# EAGLE board sunbeam2 (EAGLE 6.0), part 1 of 2
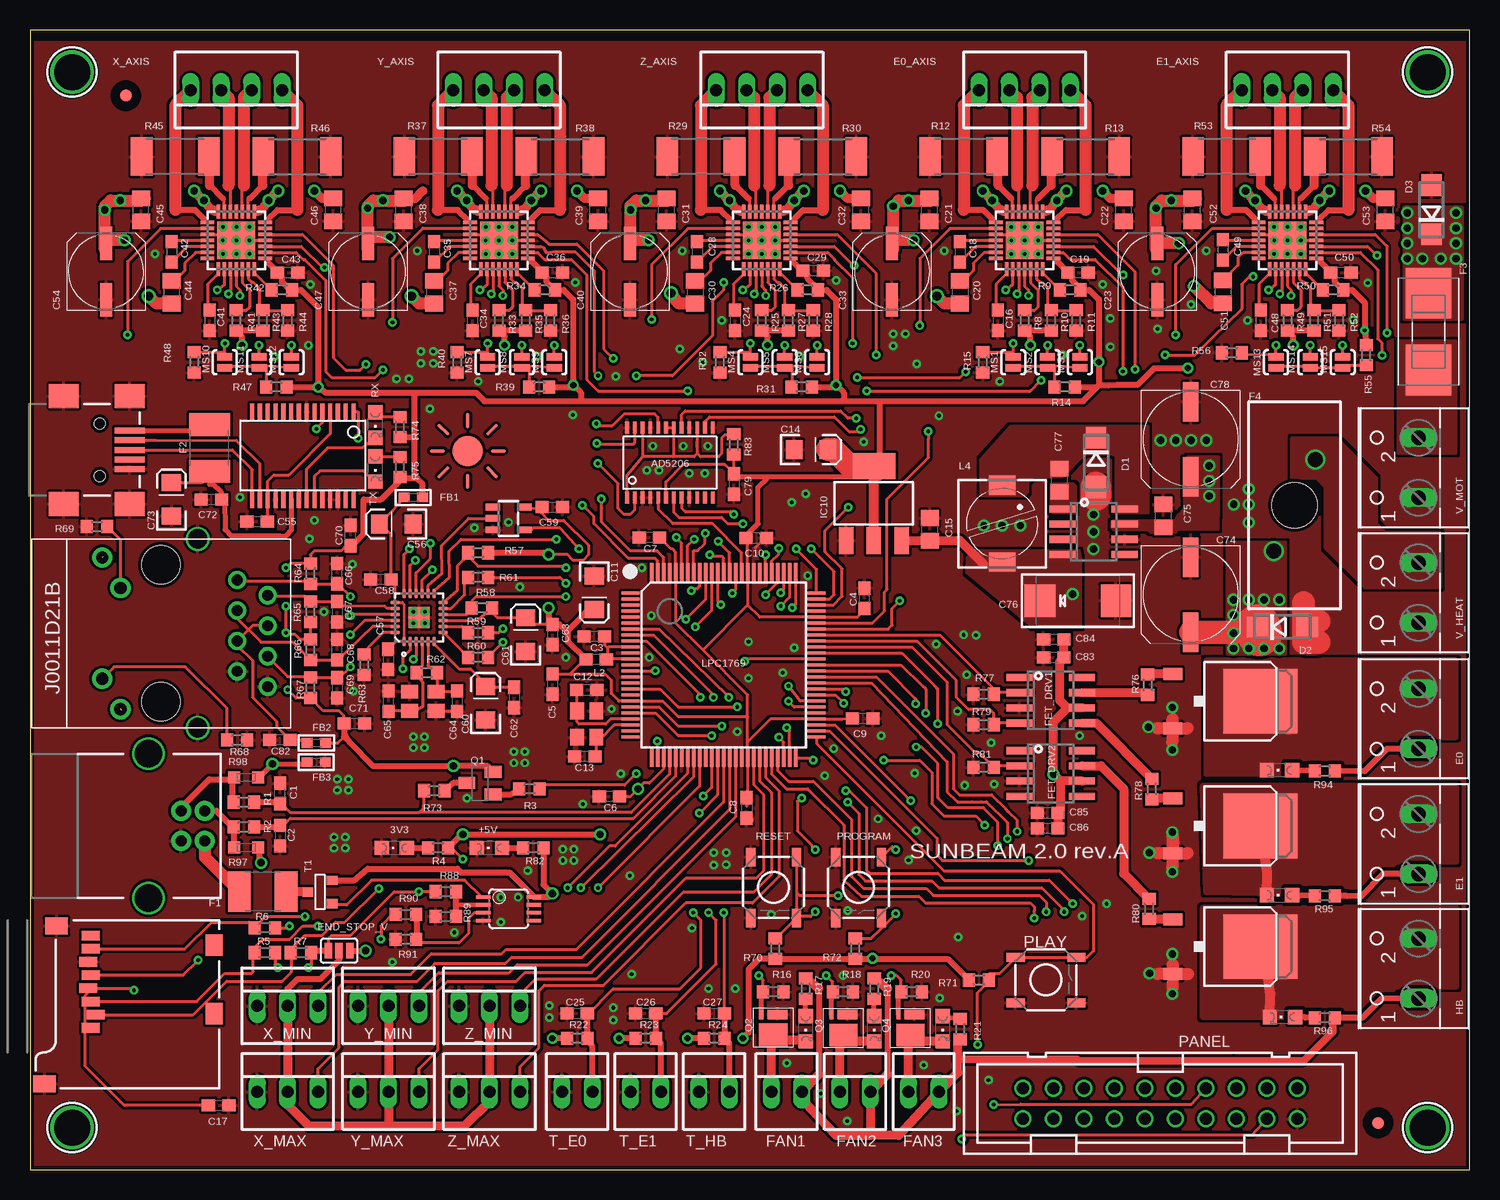
[diagram p2: board, top side]
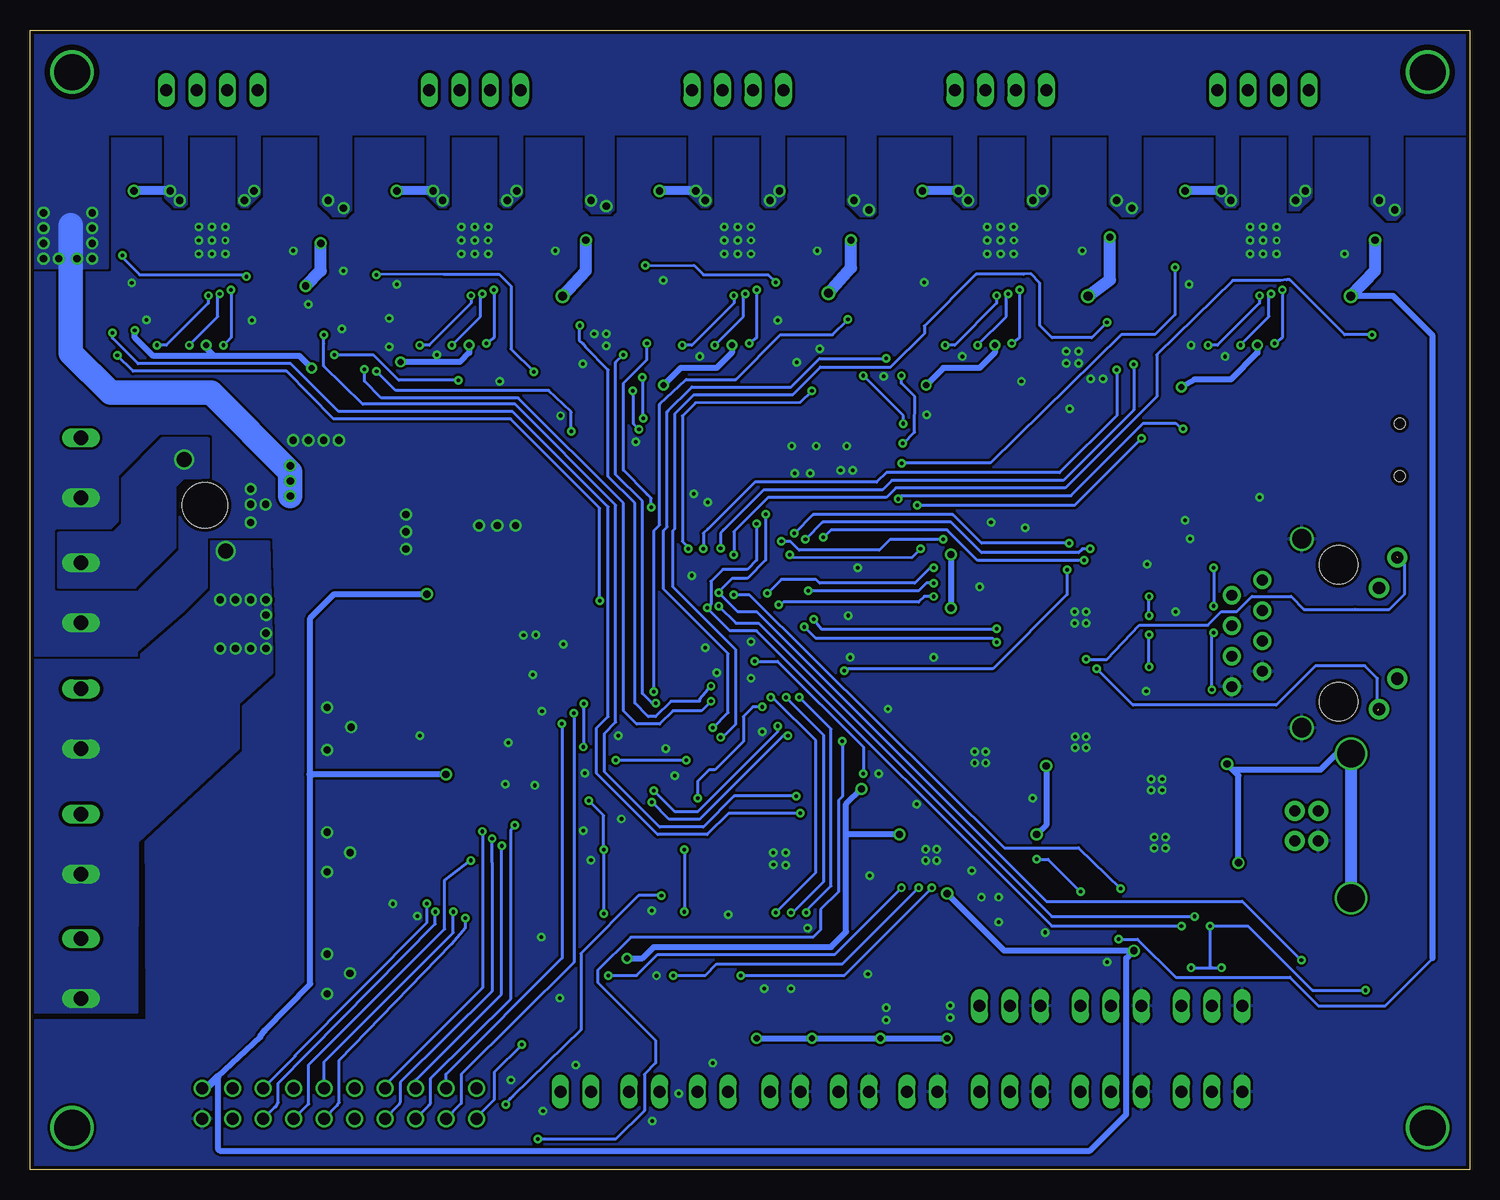
[diagram p3: board, bottom side, seen from below]

Size 120 x 95 mm. Coordinates in mm from the lower left corner, seen from the top.
Outline: 0,0 120,0 120,95 0,95 0,0
Copper layers (1*16): Top 0.07mm / dielectric 1.5mm / Bottom 0.07mm
Design rules: minimum track width 8mil, minimum drill 0.3mm, track to track 8mil, track to pad 8mil, pad to pad 8mil, via to via 8mil, smd to smd 0mil, copper to edge 12mil, drill to drill 10mil, minimum pad ring 8mil, minimum via ring 8mil, stop-mask expansion 0mil, vias tented up to drill 25mil, thermal gap 8mil

## Footprints (pad centres in the part's own frame; a part is rotated, then mirrored left to right if it is on the bottom)
CHIPLED_0805 = smd 1.2 x 1.2: A 0,-1.05; C 0,1.05
TSSOP24 = smd 0.305 x 0.991: 1 -3.575,-2.918; 2 -2.925,-2.918; 3 -2.275,-2.918; 4 -1.625,-2.918; 5 -0.975,-2.918; 6 -0.325,-2.918; 7 0.325,-2.918; 8 0.975,-2.918; 9 1.625,-2.918; 10 2.275,-2.918; 11 2.925,-2.918; 12 3.575,-2.918; 13 3.575,2.918; 14 2.925,2.918; 15 2.275,2.918; 16 1.625,2.918; 17 0.975,2.918; 18 0.325,2.918; 19 -0.325,2.918; 20 -0.975,2.918; 21 -1.625,2.918; 22 -2.275,2.918; 23 -2.925,2.918; 24 -3.575,2.918
C0603 = smd 1.1 x 1: 1 -0.85,0; 2 0.85,0
EIA3216 = smd 1.4 x 1.6: A 1.4,0; C -1.4,0
C0805 = smd 1.3 x 1.5: 1 -0.95,0; 2 0.95,0
UD-6,3X7,7_NICHICON = smd 2.8 x 1: + 2.35,0; - -2.35,0
UD-8X10_NICHICON = smd 3.3 x 1.3: + 3.125,0; - -3.125,0
EIA7343-31/D-R = smd 2.55 x 2.7: + 3.175,0; - -3.175,0
DO214AC = smd 1.8 x 1.7: A 2.05,0; C -2.05,0
W237-102 = drill 1.194 long: 1 -2.5,-1.27; 2 2.5,-1.27
22-23-2041 = drill 1 long: 1 -3.81,0; 2 -1.27,0; 3 1.27,0; 4 3.81,0
D-PAK_TO252AA = smd 1 x 1.6: 1 -2.28,-4.8; 3 2.28,-4.8 | smd 5.4 x 6.2: 4 0,2.5
SJ_3 = smd 0.635 x 1.27: 1 -0.889,0; 2 0,0; 3 0.889,0
L1812 = smd 1.9 x 3.4: 1 -1.95,0; 2 1.95,0
NANO2_SMF_FUSEBLOCK = smd 4.24 x 3.81: 1 -3.19,0; 2 3.19,0
01530008Z = drill 1.27: P$1 -1.73,-3.81; P$2 1.73,3.81 | hole 3.78: 0,0
22-23-2021 = drill 1 long: 1 -1.27,0; 2 1.27,0
_0603 = smd 0.9 x 0.8: 1 -0.762,0; 2 0.762,0
SOIC8 = smd 0.6 x 2.2: 1 -1.905,-2.6; 2 -0.635,-2.6; 3 0.635,-2.6; 4 1.905,-2.6; 5 1.905,2.6; 6 0.635,2.6; 7 -0.635,2.6; 8 -1.905,2.6
MOUNTINGHOLE_3.0_PLATEDTHIN = drill 3 pad 3.6: P$1 0,0
QFN28ET = smd 1.15 x 0.3: 1 -2.4,1.5; 2 -2.4,1; 3 -2.4,0.5; 4 -2.4,0; 5 -2.4,-0.5; 6 -2.4,-1; 7 -2.4,-1.5; 15 2.4,-1.5; 16 2.4,-1; 17 2.4,-0.5; 18 2.4,0; 19 2.4,0.5; 20 2.4,1; 21 2.4,1.5 | smd 0.3 x 1.15: 8 -1.5,-2.4; 9 -1,-2.4; 10 -0.5,-2.4; 11 0,-2.4; 12 0.5,-2.4; 13 1,-2.4; 14 1.5,-2.4; 22 1.5,2.4; 23 1,2.4; 24 0.5,2.4; 25 0,2.4; 26 -0.5,2.4; 27 -1,2.4; 28 -1.5,2.4 | smd 3.15 x 3.15: EXP 0,0
SSOP28DB = smd 0.348 x 1.397: 1 -4.225,-3.656; 2 -3.575,-3.656; 3 -2.925,-3.656; 4 -2.275,-3.656; 5 -1.625,-3.656; 6 -0.975,-3.656; 7 -0.325,-3.656; 8 0.325,-3.656; 9 0.975,-3.656; 10 1.625,-3.656; 11 2.275,-3.656; 12 2.925,-3.656; 13 3.575,-3.656; 14 4.225,-3.656; 15 4.225,3.656; 16 3.575,3.656; 17 2.925,3.656; 18 2.275,3.656; 19 1.625,3.656; 20 0.975,3.656; 21 0.325,3.656; 22 -0.325,3.656; 23 -0.975,3.656; 24 -1.625,3.656; 25 -2.275,3.656; 26 -2.925,3.656; 27 -3.575,3.656; 28 -4.225,3.656
SO08 = smd 0.6 x 2.2: 1 -1.905,-2.6; 2 -0.635,-2.6; 3 0.635,-2.6; 4 1.905,-2.6; 5 1.905,2.6; 6 0.635,2.6; 7 -0.635,2.6; 8 -1.905,2.6
MSOP08 = smd 0.3 x 1.2: 1 -0.976,-2.113; 2 -0.326,-2.113; 3 0.324,-2.113; 4 0.974,-2.113; 5 0.974,2.112; 6 0.324,2.112; 7 -0.326,2.112; 8 -0.976,2.112
SOT223 = smd 1.219 x 2.235: 1 -2.311,-3.099; 2 0,-3.099; 3 2.311,-3.099 | smd 3.6 x 2.2: TAB 0,3.099
0603 = smd 1.1 x 1: 1 -0.85,0; 2 0.85,0
PIS2816 = smd 2.2 x 1.6: 1 0,3.2; 2 0,-3.2
LQFP100 = smd 0.27 x 1.5: 1 -6,-7.75; 2 -5.5,-7.75; 3 -5,-7.75; 4 -4.5,-7.75; 5 -4,-7.75; 6 -3.5,-7.75; 7 -3,-7.75; 8 -2.5,-7.75; 9 -2,-7.75; 10 -1.5,-7.75; 11 -1,-7.75; 12 -0.5,-7.75; 13 0,-7.75; 14 0.5,-7.75; 15 1,-7.75; 16 1.5,-7.75; 17 2,-7.75; 18 2.5,-7.75; 19 3,-7.75; 20 3.5,-7.75; 21 4,-7.75; 22 4.5,-7.75; 23 5,-7.75; 24 5.5,-7.75; 25 6,-7.75; 51 6,7.75; 52 5.5,7.75; 53 5,7.75; 54 4.5,7.75; 55 4,7.75; 56 3.5,7.75; 57 3,7.75; 58 2.5,7.75; 59 2,7.75; 60 1.5,7.75; 61 1,7.75; 62 0.5,7.75; 63 0,7.75; 64 -0.5,7.75; 65 -1,7.75; 66 -1.5,7.75; 67 -2,7.75; 68 -2.5,7.75; 69 -3,7.75; 70 -3.5,7.75; 71 -4,7.75; 72 -4.5,7.75; 73 -5,7.75; 74 -5.5,7.75; 75 -6,7.75 | smd 1.5 x 0.27: 26 7.75,-6; 27 7.75,-5.5; 28 7.75,-5; 29 7.75,-4.5; 30 7.75,-4; 31 7.75,-3.5; 32 7.75,-3; 33 7.75,-2.5; 34 7.75,-2; 35 7.75,-1.5; 36 7.75,-1; 37 7.75,-0.5; 38 7.75,0; 39 7.75,0.5; 40 7.75,1; 41 7.75,1.5; 42 7.75,2; 43 7.75,2.5; 44 7.75,3; 45 7.75,3.5; 46 7.75,4; 47 7.75,4.5; 48 7.75,5; 49 7.75,5.5; 50 7.75,6; 76 -7.75,6; 77 -7.75,5.5; 78 -7.75,5; 79 -7.75,4.5; 80 -7.75,4; 81 -7.75,3.5; 82 -7.75,3; 83 -7.75,2.5; 84 -7.75,2; 85 -7.75,1.5; 86 -7.75,1; 87 -7.75,0.5; 88 -7.75,0; 89 -7.75,-0.5; 90 -7.75,-1; 91 -7.75,-1.5; 92 -7.75,-2; 93 -7.75,-2.5; 94 -7.75,-3; 95 -7.75,-3.5; 96 -7.75,-4; 97 -7.75,-4.5; 98 -7.75,-5; 99 -7.75,-5.5; 100 -7.75,-6
SJ_2S-NO = smd 0.635 x 1.27: 1 -0.45,0; 2 0.45,0
PAK100/2500-20 = drill 1 pad 1.422: 1 -11.43,-1.27; 2 -11.43,1.27; 3 -8.89,-1.27; 4 -8.89,1.27; 5 -6.35,-1.27; 6 -6.35,1.27; 7 -3.81,-1.27; 8 -3.81,1.27; 9 -1.27,-1.27; 10 -1.27,1.27; 11 1.27,-1.27; 12 1.27,1.27; 13 3.81,-1.27; 14 3.81,1.27; 15 6.35,-1.27; 16 6.35,1.27; 17 8.89,-1.27; 18 8.89,1.27; 19 11.43,-1.27; 20 11.43,1.27
TACTILE_SWITCH_SMD = smd 1.524 x 0.762: 1 -2.54,1.905; 2 2.54,1.905; 3 -2.54,-1.905; 4 2.54,-1.905
SOT23-BEC = smd 1 x 1.4: B -0.95,-1.1; C 0,1.1; E 0.95,-1.1
PQFN33 = smd 1.9 x 2.35: D 0,0 | smd 0.8 x 0.35: G -1.7,-1 | smd 0.8 x 1.68: S -1.7,0.35
R0603 = smd 1 x 1.1: 1 -0.85,0; 2 0.85,0
R2512 = smd 1.8 x 3.2: 1 -2.8,0; 2 2.8,0
CT/CN0603 = smd 1 x 1: 1 -1,0; 2 1,0
J0011D21B = drill 1.6: CHS1 7.874,-3.048; CHS2 -7.874,-3.048 | drill 0.889 pad 1.524: CT 0.635,-8.89; CT2 -0.635,-6.35; GND -4.445,-8.89; NC -3.175,-6.35; RD+ 1.905,-6.35; RD- -1.905,-8.89; TD+ 4.445,-6.35; TD- 3.175,-8.89 | drill 1.016 pad 1.676: G 6.325,4.902; G_GND 3.785,3.378; Y -6.325,3.378; Y_GND -3.785,4.902 | hole 3.2: -5.715,0; 5.715,0
SOT-23 = smd 0.787 x 0.889: 1 0.025,-1.016; 2 -0.94,1.016; 3 0.991,1.016
MICRO-SD-SOCKET-PP = smd 0.8 x 1.5: 1 -8.94,10.7; 2 -7.84,10.3; 3 -6.74,10.7; 4 -5.64,10.9; 5 -4.54,10.7; 6 -3.44,10.9; 7 -2.34,10.7; 8 -1.24,10.7 | smd 1.8 x 1.4: CD1 -2.05,0.4; CD2 -7.75,0.4 | smd 1.4 x 1.9: GND1 -13.6,14.55; GND3 -0.45,13.55
QFN24_4MM = smd 0.8 x 0.28: 1 -2,1.25; 2 -2,0.75; 3 -2,0.25; 4 -2,-0.25; 5 -2,-0.75; 6 -2,-1.25; 13 2,-1.25; 14 2,-0.75; 15 2,-0.25; 16 2,0.25; 17 2,0.75; 18 2,1.25 | smd 0.28 x 0.8: 7 -1.25,-2; 8 -0.75,-2; 9 -0.25,-2; 10 0.25,-2; 11 0.75,-2; 12 1.25,-2; 19 1.25,2; 20 0.75,2; 21 0.25,2; 22 -0.25,2; 23 -0.75,2; 24 -1.25,2 | smd 1.778 x 1.778: THERM 0,0
SOT23-5 = smd 0.55 x 1.2: 1 -0.95,-1.3; 2 0,-1.3; 3 0.95,-1.3; 4 0.95,1.3; 5 -0.95,1.3
USB-B-PTH = drill 0.914 pad 1.676: D+ 0,1.25; D- 1.981,1.25; GND 0,-1.25; VBUS 1.981,-1.25 | drill 2.286: S1 -2.718,-6.02; S2 -2.718,6.02
CRYSTAL2734 = smd 1.4 x 1.15: GND1 1.1,-0.8; GND2 -1.1,0.8; XTAL1 1.1,0.8; XTAL2 -1.1,-0.8
USB-MINIB = smd 2.5 x 0.5: D+ 2.5,0; D- 2.5,0.8; GND 2.5,-1.6; ID 2.5,-0.8; VBUS 2.5,1.6 | smd 2.5 x 2: MTN1 -3,4.5; MTN2 2.5,4.5; MTN3 -3,-4.5; MTN4 2.5,-4.5 | hole 0.9: 0,2.2; 0,-2.2
SUN = smd 2.54 x 2.54: P$1 0,0 | smd 0.305 x 1.27: P$2 0,2.54; P$3 0,-2.54 | smd 1.27 x 0.305: P$4 2.54,0; P$5 -2.54,0 | smd 1.27 x 0.305 rotated 45: P$6 2.032,1.778 | smd 1.27 x 0.305 rotated 135: P$7 2.032,-1.778 | smd 1.27 x 0.305 rotated 225: P$8 -2.032,-1.778 | smd 1.27 x 0.305 rotated 315: P$9 -2.032,1.778
FIDUCIAL_1MM = smd 1 x 1: 1 0,0
22-23-2031 = drill 1 long: 1 -2.54,0; 2 0,0; 3 2.54,0

## Placement (x,y rotation side)
3V3  [CHIPLED_0805]  30.37,26.82 90 top
+5V  [CHIPLED_0805]  38.31,26.82 90 top
AD5206  AD5206  [TSSOP24]  53.34,58.93 0 top
C1  18pF  [C0603]  20.84,31.36 90 top
C2  18pF  [C0603]  20.84,27.83 270 top
C3  0.1uF  [C0603]  47.04,44.44 180 top
C4  0.1uF  [C0603]  69.58,47.61 90 top
C5  0.1uF  [C0603]  43.54,40.47 270 top
C6  0.1uF  [C0603]  48.31,31.1 180 top
C7  0.1uF  [C0603]  51.64,52.69 180 top
C8  0.1uF  [C0603]  59.74,30.15 270 top
C9  0.1uF  [C0603]  69.42,37.61 0 top
C10  0.1uF  [C0603]  60.53,52.66 0 top
C11  10uF  [EIA3216]  47.04,48.09 270 top
C12  18pF  [C0603]  46.4,39.99 0 top
C13  18pF  [C0603]  46.24,34.44 180 top
C14  10uF  [EIA3216]  65.11,60.02 0 top
C15  0.1uF  [C0805]  75.01,53.36 90 top
C16  .22uF  [C0603]  80.69,70.79 270 top
C17  0.1uF  [C0603]  15.73,5.35 0 top
C18  1uF  [C0603]  77.52,76.5 270 top
C19  0.1uF  [C0603]  87.36,74.76 180 top
C20  0.1uF  [C0805]  77.52,73.14 270 top
C21  0.1uF  [C0805]  74.98,80 90 top
C22  0.1uF  [C0805]  91.17,80 90 top
C23  100uF  [UD-6,3X7,7_NICHICON]  93.96,74.85 90 top
C24  .22uF  [C0603]  58.78,70.79 270 top
C25  10uF  [C0603]  45.61,13 0 top
C26  10uF  [C0603]  51.32,13 0 top
C27  10uF  [C0603]  57.04,13 0 top
C28  1uF  [C0603]  55.61,76.5 270 top
C29  0.1uF  [C0603]  65.29,74.92 180 top
C30  0.1uF  [C0805]  55.45,73.14 270 top
C31  0.1uF  [C0805]  53.07,80 90 top
C32  0.1uF  [C0805]  69.26,80 90 top
C33  100uF  [UD-6,3X7,7_NICHICON]  71.87,74.85 90 top
C34  .22uF  [C0603]  36.88,70.79 270 top
C35  1uF  [C0603]  33.7,76.5 270 top
C36  0.1uF  [C0603]  43.54,74.76 180 top
C37  0.1uF  [C0805]  33.7,73.14 270 top
C38  0.1uF  [C0805]  31.16,80 90 top
C39  0.1uF  [C0805]  47.35,80 90 top
C40  100uF  [UD-6,3X7,7_NICHICON]  50.02,74.85 90 top
C41  .22uF  [C0603]  14.97,70.79 270 top
C42  1uF  [C0603]  11.79,76.5 270 top
C43  0.1uF  [C0603]  21.48,74.76 180 top
C44  0.1uF  [C0805]  11.79,73.14 270 top
C45  0.1uF  [C0805]  9.25,80 90 top
C46  0.1uF  [C0805]  25.29,80 90 top
C47  100uF  [UD-6,3X7,7_NICHICON]  28.18,74.85 90 top
C48  .22uF  [C0603]  102.6,70.79 270 top
C49  1uF  [C0603]  99.42,76.66 270 top
C50  0.1uF  [C0603]  109.27,74.76 180 top
C51  0.1uF  [C0805]  99.42,73.17 270 top
C52  0.1uF  [C0805]  96.88,80 90 top
C53  0.1uF  [C0805]  112.98,80 90 top
C54  100uF  [UD-6,3X7,7_NICHICON]  6.33,74.85 90 top
C55  0.1uF  [C0603]  18.94,54.03 0 top
C56  10uF  [EIA3216]  30.53,53.8 180 top
C57  0.1uF  [C0603]  29.86,42.53 270 top
C58  0.1uF  [C0603]  29.26,49.2 180 top
C59  0.1uF  [C0603]  43.54,55.23 0 top
C60  1uF  [EIA3216]  37.99,38.88 90 top
C61  10uF  [EIA3216]  41.32,44.6 90 top
C62  470pF  [C0603]  40.37,39.36 270 top
C63  0.1uF  [C0603]  43.54,44.6 270 top
C64  18pF  [C0603]  35.61,39.04 270 top
C65  18pF  [C0603]  29.89,39.04 90 top
C66  18pF  [C0603]  25.61,49.68 90 top
C67  18pF  [C0603]  25.61,46.5 270 top
C68  18pF  [C0603]  25.61,43.33 90 top
C69  18pF  [C0603]  25.61,40.15 270 top
C70  1uF  [C0603]  26.72,52.85 90 top
C71  1uF  [C0603]  27.03,37.2 0 top
C72  0.1uF  [C0603]  15.13,55.87 0 top
C73  10uF  [EIA3216]  11.79,55.87 90 top
C74  220uF  [UD-8X10_NICHICON]  96.76,47.93 270 top
C75  470nF  [C0805]  94.47,54.5 90 top
C76  47uF  [EIA7343-31/D-R]  87.36,47.42 180 top
C77  10nF  [C0805]  85.8,57.45 90 top
C78  100uF  [UD-8X10_NICHICON]  96.76,60.88 270 top
C79  0.1uF  [C0603]  58.67,57.15 270 top
C82  0.1uF  [C0603]  20.83,35.81 180 top
C83  0.1uF  [C0603]  85.34,42.67 180 top
C84  0.1uF  [C0603]  85.34,44.2 180 top
C85  4.7uF  [C0603]  84.84,29.72 180 top
C86  4.7uF  [C0603]  84.84,28.45 180 top
D1  SS14  [DO214AC]  88.85,58.95 270 top
D2  M4  [DO214AC]  104.39,45.21 0 top
D3  M4  [DO214AC]  116.84,80.01 90 top
E0  Extruder0  [W237-102]  114.47,37.58 90 top
E0_AXIS  22-23-2041  [22-23-2041]  82.91,90 180 top
E0_FET  IRLR8743  [D-PAK_TO252AA]  100.06,39.04 270 top
E1  Extruder1  [W237-102]  114.47,27.13 90 top
E1_AXIS  22-23-2041  [22-23-2041]  104.82,90 180 top
E1_FET  IRLR8743  [D-PAK_TO252AA]  100.06,28.64 270 top
END_STOP_V  [SJ_3]  25.76,18.24 180 top
F1  500mA  [L1812]  19.41,23.16 180 top
F2  500mA  [L1812]  14.97,60.15 90 top
F3  SMF_OMNIBLOK_154.062  [NANO2_SMF_FUSEBLOCK]  116.59,69.85 90 top
F4  01530008Z  [01530008Z]  105.41,55.37 180 top
FAN1  22-23-2021  [22-23-2021]  63.07,6.5 0 top
FAN2  22-23-2021  [22-23-2021]  68.79,6.5 0 top
FAN3  22-23-2021  [22-23-2021]  74.5,6.5 0 top
FB1  [_0603]  31.96,56.03 180 top
FB2  [_0603]  23.88,35.56 180 top
FB3  [_0603]  23.86,33.96 180 top
FET_DRV1  TC4427  [SOIC8]  85.09,39.12 270 top
FET_DRV2  TC4427  [SOIC8]  85.09,33.02 270 top
GND  MOUNTINGHOLE3.0THIN  [MOUNTINGHOLE_3.0_PLATEDTHIN]  3.5,91.5 0 top
HB  HotBed  [W237-102]  114.47,16.75 90 top
HOTBET_FET  IRLR8743  [D-PAK_TO252AA]  100.06,18.58 270 top
IC2  A4983  [QFN28ET]  82.91,77.46 0 top
IC3  A4983  [QFN28ET]  61.01,77.46 0 top
IC4  A4983  [QFN28ET]  39.1,77.46 0 top
IC5  A4983  [QFN28ET]  17.19,77.46 0 top
IC6  A4983  [QFN28ET]  104.82,77.46 0 top
IC7  FT232RLSSOP  [SSOP28DB]  22.75,59.52 180 top
IC8  LM2675  [SO08]  88.66,53.17 270 top
IC9  LMV358MMX  [MSOP08]  39.89,21.74 270 top
IC10  LM1117IMPX-3.3  [SOT223]  70.34,55.55 0 top
L2  [0603]  47.2,42.53 180 top
L4  33uH  [PIS2816]  81.03,53.85 0 top
LED2  [CHIPLED_0805]  64.66,11.73 180 top
LED3  [CHIPLED_0805]  70.37,11.73 180 top
LED4  [CHIPLED_0805]  76.09,11.73 180 top
LED6  [CHIPLED_0805]  104.16,33.29 90 top
LED7  [CHIPLED_0805]  104.16,22.87 90 top
LED8  [CHIPLED_0805]  104.4,12.71 90 top
LPC1769  [LQFP100]  57.83,42.06 270 top
MS1  SOLDERJUMPERNO  [SJ_2S-NO]  81.96,67.3 90 top
MS2  SOLDERJUMPERNO  [SJ_2S-NO]  84.82,67.3 90 top
MS3  SOLDERJUMPERNO  [SJ_2S-NO]  87.52,67.3 90 top
MS4  SOLDERJUMPERNO  [SJ_2S-NO]  60.05,67.3 90 top
MS5  SOLDERJUMPERNO  [SJ_2S-NO]  62.91,67.3 90 top
MS6  SOLDERJUMPERNO  [SJ_2S-NO]  65.61,67.3 90 top
MS7  SOLDERJUMPERNO  [SJ_2S-NO]  38.15,67.3 90 top
MS8  SOLDERJUMPERNO  [SJ_2S-NO]  41,67.3 90 top
MS9  SOLDERJUMPERNO  [SJ_2S-NO]  43.7,67.3 90 top
MS10  SOLDERJUMPERNO  [SJ_2S-NO]  16.24,67.3 90 top
MS11  SOLDERJUMPERNO  [SJ_2S-NO]  19.1,67.3 90 top
MS12  SOLDERJUMPERNO  [SJ_2S-NO]  21.8,67.3 90 top
MS13  SOLDERJUMPERNO  [SJ_2S-NO]  103.87,67.3 90 top
MS14  SOLDERJUMPERNO  [SJ_2S-NO]  106.73,67.3 90 top
MS15  SOLDERJUMPERNO  [SJ_2S-NO]  109.43,67.3 90 top
PANEL  2520-  [PAK100/2500-20]  94.22,5.51 180 top
PLAY  [TACTILE_SWITCH_SMD]  84.7,15.8 0 top
PROGRAM  [TACTILE_SWITCH_SMD]  69.07,23.51 270 top
Q1  BC857ALT1SMD  [SOT23-BEC]  37.51,32.21 90 top
Q2  IRLHM630TR2PBF  [PQFN33]  61.96,11.23 270 top
Q3  IRLHM630TR2PBF  [PQFN33]  67.8,11.21 270 top
Q4  IRLHM630TR2PBF  [PQFN33]  73.39,11.21 270 top
R1  33R  [R0603]  17.83,30.63 0 top
R2  33R  [R0603]  17.83,28.56 0 top
R3  470R  [R0603]  41.64,31.74 180 top
R4  1K  [R0603]  34.02,26.82 180 top
R5  10K  [R0603]  19.57,18.08 0 top
R6  10K  [R0603]  19.57,20.15 0 top
R7  10K  [R0603]  22.59,18.08 0 top
R8  10K  [R0603]  82.91,70.79 90 top
R9  10K  [R0603]  86.72,73.33 180 top
R10  10K  [R0603]  85.14,70.79 90 top
R11  10K  [R0603]  87.2,70.79 90 top
R12  0.5R  [R2512]  77.83,84.44 180 top
R13  0.5R  [R2512]  87.99,84.44 0 top
R14  10K  [R0603]  86.25,65.23 0 top
R15  10K  [R0603]  79.42,67.3 270 top
R16  10K  [R0603]  61.96,14.81 180 top
R17  1K5  [R0603]  64.66,15.07 270 top
R18  10K  [R0603]  67.77,14.81 180 top
R19  1K5  [R0603]  70.37,15.07 270 top
R20  10K  [R0603]  73.49,14.81 180 top
R21  1K5  [R0603]  77.55,11.7 90 top
R22  4K7  [R0603]  45.61,10.94 180 top
R23  4K7  [R0603]  51.32,10.94 180 top
R24  4K7  [R0603]  57.04,10.94 180 top
R25  10K  [R0603]  61.01,70.79 90 top
R26  10K  [R0603]  64.82,73.33 180 top
R27  10K  [R0603]  63.23,70.79 90 top
R28  10K  [R0603]  65.29,70.79 90 top
R29  0.5R  [R2512]  55.93,84.44 180 top
R30  0.5R  [R2512]  66.09,84.44 0 top
R31  10K  [R0603]  64.34,65.23 0 top
R32  10K  [R0603]  57.51,67.3 270 top
R33  10K  [R0603]  39.1,70.79 90 top
R34  10K  [R0603]  42.91,73.33 180 top
R35  10K  [R0603]  41.32,70.79 90 top
R36  10K  [R0603]  43.39,70.79 90 top
R37  0.5R  [R2512]  34.02,84.44 180 top
R38  0.5R  [R2512]  44.18,84.44 0 top
R39  10K  [R0603]  42.43,65.23 0 top
R40  10K  [R0603]  35.61,67.3 270 top
R41  10K  [R0603]  17.19,70.79 90 top
R42  10K  [R0603]  21,73.33 180 top
R43  10K  [R0603]  19.41,70.79 90 top
R44  10K  [R0603]  21.48,70.79 90 top
R45  0.5R  [R2512]  12.11,84.44 180 top
R46  0.5R  [R2512]  22.27,84.44 0 top
R47  10K  [R0603]  20.53,65.23 0 top
R48  10K  [R0603]  13.7,67.3 270 top
R49  10K  [R0603]  104.82,70.79 90 top
R50  10K  [R0603]  108.63,73.33 180 top
R51  10K  [R0603]  107.04,70.79 90 top
R52  10K  [R0603]  109.11,70.79 90 top
R53  0.5R  [R2512]  99.74,84.44 180 top
R54  0.5R  [R2512]  109.9,84.44 0 top
R55  10K  [R0603]  111.39,67.9 90 top
R56  10K  [R0603]  100.19,68.09 180 top
R57  1K5  [R0603]  37.35,51.42 180 top
R58  10K  [R0603]  37.67,46.82 180 top
R59  22R  [R0603]  37.35,44.75 0 top
R60  22R  [R0603]  37.35,42.69 0 top
R61  22R  [R0603]  37.35,49.36 0 top
R62  1M  [R0603]  33.07,41.42 180 top
R63  1K5  [R0603]  27.86,42.09 270 top
R64  49.9R  [R0603]  23.38,49.68 270 top
R65  49.9R  [R0603]  23.38,46.5 90 top
R66  49.9R  [R0603]  23.38,43.33 270 top
R67  49.9R  [R0603]  23.38,40.15 90 top
R68  330R  [R0603]  17.27,35.81 0 top
R69  330R  [R0603]  5.59,53.59 180 top
R70  10K  [R0603]  62.12,18.4 270 top
R71  10K  [R0603]  79.11,15.8 180 top
R72  10K  [R0603]  68.79,18.4 270 top
R73  1K5  [R0603]  33.7,31.58 0 top
R74  1K  [R0603]  30.84,61.9 90 top
R75  1K  [R0603]  30.84,58.57 90 top
R76  22R  [R0603]  93.17,40.41 270 top
R77  10K  [R0603]  79.5,39.62 180 top
R78  22R  [R0603]  93.51,31.72 90 top
R79  10K  [R0603]  79.5,37.08 180 top
R80  22R  [R0603]  93.28,21.73 90 top
R81  10K  [R0603]  79.5,33.53 180 top
R82  1K  [R0603]  41.96,26.82 180 top
R83  10K  [R0603]  58.67,60.45 270 top
R88  10K  [R0603]  34.65,23.16 180 top
R89  10K  [R0603]  34.65,21.1 180 top
R90  4K7  [R0603]  31.32,21.26 180 top
R91  1K  [R0603]  31.32,19.2 180 top
R94  1K5  [R0603]  107.93,33.23 180 top
R95  1K5  [R0603]  107.93,22.82 180 top
R96  1K5  [R0603]  107.94,12.66 180 top
R97  VARISTORCN0603  [CT/CN0603]  18.02,26.85 0 top
R98  VARISTORCN0603  [CT/CN0603]  18.02,32.69 0 top
RESET  [TACTILE_SWITCH_SMD]  61.99,23.51 270 top
RJ1  ETHERNET  [J0011D21B]  10.92,44.7 90 top
RX  [CHIPLED_0805]  28.78,62.06 180 top
T1  IRLML2246TRPBF  [SOT-23]  24.18,23.16 270 top
T_E0  22-23-2021  [22-23-2021]  45.61,6.5 0 top
T_E1  22-23-2021  [22-23-2021]  51.32,6.5 0 top
T_HB  22-23-2021  [22-23-2021]  57.04,6.5 0 top
TX  [CHIPLED_0805]  28.78,58.41 180 top
U2  USD-SOCKETNEW  [MICRO-SD-SOCKET-PP]  15.76,20.75 90 top
U3  [QFN24_4MM]  32.43,46.02 90 top
U4  [SOT23-5]  39.89,54.28 270 top
U$1  USB+SHIELD  [USB-B-PTH]  12.59,28.66 0 top
U$3  12Mhz  [CRYSTAL2734]  46.4,37.13 270 top
U$7  USB-MINIB-5PIN  [USB-MINIB]  5.83,59.99 0 top
U$8  25Mhz  [CRYSTAL2734]  32.75,39.04 180 top
U$17  MOUNTINGHOLE3.0THIN  [MOUNTINGHOLE_3.0_PLATEDTHIN]  3.5,3.5 0 top
U$18  MOUNTINGHOLE3.0THIN  [MOUNTINGHOLE_3.0_PLATEDTHIN]  116.5,3.5 0 top
U$20  MOUNTINGHOLE3.0THIN  [MOUNTINGHOLE_3.0_PLATEDTHIN]  116.5,91.5 0 top
U$21  SUNLOGO  [SUN]  36.5,59.9 0 top
U$22  FIDUCIAL  [FIDUCIAL_1MM]  112.38,3.89 0 top
U$23  FIDUCIAL  [FIDUCIAL_1MM]  7.98,89.52 0 top
V_HEAT  HEATERS  [W237-102]  114.47,48.09 90 top
V_MOT  MOTORS  [W237-102]  114.47,58.5 90 top
X_AXIS  22-23-2041  [22-23-2041]  17.19,90 180 top
X_MAX  22-23-2031  [22-23-2031]  21.48,6.5 0 top
X_MIN  22-23-2031  [22-23-2031]  21.48,13.64 0 top
Y_AXIS  22-23-2041  [22-23-2041]  39.1,90 180 top
Y_MAX  22-23-2031  [22-23-2031]  29.89,6.5 0 top
Y_MIN  22-23-2031  [22-23-2031]  29.89,13.64 0 top
Z_AXIS  22-23-2041  [22-23-2041]  61.01,90 180 top
Z_MAX  22-23-2031  [22-23-2031]  38.31,6.5 0 top
Z_MIN  22-23-2031  [22-23-2031]  38.31,13.64 0 top

## Tracks (layer width: path | path; a pad name or v marks a point on that pad's centre or on a via)
1,65V
  Top 0.381: IC9.2 35.51,22.06
  Top 0.508: R89.1 35.51,22.06 R88.1
5V  (via drill 0.6)
  Top 0.305: C15.1 74.72,52.41 74.68,52.45
  Top 0.508: T1.2 27.02,24.11 28.15,25.07 35.61,25.07 35.92,24.75 39.97,24.75 IC9.8 43.25,22.71 v43.55,23.01 42.81,23.74 R82.1 | END_STOP_V.1 v27.99,18.24
  Top 0.762: 79.5,50.46 77.5,52.45 74.68,52.45 IC10.3 72.91,51.97 | FET_DRV2.6 85.89,32.38 | 85.89,32.38 v85.33,32.94 85.33,37.32 86.49,38.48 | FET_DRV1.6 86.49,38.48 | 85.89,32.38 85.89,29.92 C85.1 C86.1 | 86.49,38.48 85.85,39.12 85.85,42.33 C83.1 C84.1
  Bottom 0.508: v43.55,23.01 38.78,18.24 v27.99,18.24 28.62,17.61 28.62,4.59 31.64,1.57 104.19,1.57 104.35,1.73 104.35,7.73 100.79,11.06 100.77,11.16 100.42,11.6 | 100.42,11.6 96.63,15.48 96.63,32.94 96.63,45.96 94.63,47.96 v86.92,47.96 | v85.33,32.94 96.5,32.94 | 100.42,11.61 100.42,11.6
  Bottom 0.61: PANEL.1 105.3,6.78 104.35,7.73
  Bottom 0.635: 96.5,32.94 96.63,32.94
  pour Top (no thermals): 87.49,51.58 78.6,51.58 78.09,51 78.07,49.79 83.58,45.23 87.61,45.23 87.61,50.95
+3V3  (via drill 0.3, 0.5, 0.51, 0.6)
  Top 0.254: U3.9 37.32,45.77 R58.1 38.31,46.66 38.97,46 C61.A 41.71,45.45 C63.1 43.44,45.45 43.39,45.39 | R65.1 R66.1 22.53,44.18 22.11,44.6 21.48,44.6 v21.32,44.76 v21.32,46.98 | C71.1 26.18,37.83 25.77,38.25 24.44,38.25 R67.1 22.17,39.3 v21.48,39.99 | LPC1769.28 52.83,33.41 51.64,32.21 51.16,32.21 v50.69,31.74 50.05,31.1 C6.1 49.1,31.1 | C5.1 45.03,41.32 | 45.03,41.32 46.24,42.53 L2.2 | 45.03,41.32 45.09,41.26 47.99,41.26 48.47,40.79 48.47,39.67 49.09,39.06 LPC1769.19 52.74,39.06 54.02,37.77 59.83,37.77 | R64.1 21.69,50.53 v21.32,50.15 | C9.1 67.72,37.56 LPC1769.54 61.75,37.56 59.83,35.64 LPC1769.42 | LPC1769.42 59.83,30.4 59.74,30.31 C8.1 | 59.83,52.72 LPC1769.84 59.83,47.07 | C70.1 26.34,52 25.92,51.58 23.7,51.58 23.38,51.26 R64.1 | R64.1 23.38,50.47 | LPC1769.42 59.83,37.77 | 59.83,37.77 59.83,39.58 56.09,43.33 | 56.09,43.33 53.83,45.58 LPC1769.96 53.83,51.45 53.55,51.74 53.44,51.74 C7.1 | 59.83,47.07 56.09,43.33 | 59.83,47.07 60.85,46.06 LPC1769.71 68.98,46.06 69.58,46.66 C4.1 | U4.5 42.59,55.07 | 42.59,55.07 42.59,54.76 43.23,54.12 44.5,54.12 46.56,52.06 46.56,51.26 46.09,50.79 45.29,50.79 44.81,51.26 v43.23,51.26 | R7.2 23.44,17.03 v23.23,16.82 | R5.2 20.42,17.08 v20.68,16.82 | R6.2 21.48,20.15 v21.64,20.31 | R4.1 35.13,26.82 v36.08,25.86 | R88.2 v32.43,23.16 30.37,23.16 26.72,19.51 25.13,19.51 24.88,19.26 END_STOP_V.3 | IC3.15 63.41,75.85 63.55,75.71 | IC5.15 19.59,75.85 19.73,75.71 | IC4.15 41.5,75.85 41.64,75.71 | IC2.15 85.31,75.85 85.45,75.71 | IC6.15 107.22,75.85 107.36,75.71 | 25.92,37.2 26.64,35.63 | v8.65,14.94 8.57,15.11 U2.4 5.21,15.11 4.57,14.48 4.57,8.64 7.86,5.35
  Top 0.254: 42.59,55.07 42.59,55.13 C59.1 | 7.86,5.35 7.87,5.33 | C17.1 7.86,5.35 | R83.2 C79.1 58.67,58.01 57.94,58.75 54.44,58.76 53.02,57.33 AD5206.6 | FB2.1 25.66,35.56 26.18,36.08
  Top 0.406: 70.34,57.71 61.47,57.71 | 61.47,57.71 58.87,57.71 58.67,57.91 C79.1 | 61.47,57.71 61.47,57.66 60.71,56.9 60.71,53.85 59.83,52.97 59.83,52.72 59.75,52.72 C10.1
  Top 0.508: v105.3,68.73 105.3,69.46 R49.1 R51.1 | 89.11,65.39 v89.11,67.33 89.11,72.54 88.31,73.33 R9.1 87.58,73.43 86.88,74.12 86.88,74.39 C19.2 86.57,74.76 85.61,75.71 85.45,75.71 | R14.2 88.95,65.23 | 88.95,65.23 89.11,65.39 | v83.39,68.73 83.39,69.46 R8.1 R10.1 | v67.2,65.39 67.2,72.54 66.41,73.33 R26.1 65.67,73.43 64.82,74.28 64.82,74.54 C29.2 64.5,74.86 64.5,74.76 63.55,75.71 | v67.2,65.39 67.83,64.76 67.83,64.12 67.64,64.06 | R31.2 67.04,65.23 v67.2,65.39 | v61.48,68.73 61.48,69.46 R25.1 R27.1 | v45.29,65.39 45.29,72.54 44.5,73.33 R34.1 43.7,73.33 43.07,73.97 43.07,74.39 C36.2 42.75,74.76 41.8,75.71 41.64,75.71 | v45.29,65.39 45.93,64.76 45.93,64.22 46.09,64.06 | R39.2 45.13,65.23 v45.29,65.39 | v39.58,68.73 39.58,69.46 R33.1 R35.1 | v24.02,65.23 24.02,71.9 22.59,73.33 R42.1 21.64,73.33 21,73.97 21,74.39 C43.2 20.68,74.76 19.73,75.71 | v24.02,65.23 24.65,64.76 32.27,64.76 | R47.2 v24.02,65.23 | v17.67,68.73 17.67,69.46 R41.1 R43.1 | 32.27,64.76 37.2,64.76 37.89,64.06 46.09,64.06 | 46.09,64.06 67.64,64.06 | 67.64,64.06 70.85,64.06 | 70.85,64.06 87.77,64.06 88.95,65.23 | C63.1 44.12,45.45 44.81,44.76 | 44.81,44.76 44.81,44.01 L2.2 | C70.1 26.98,52.16 27.83,53.01 27.83,55.87 29.26,55.87 31,57.61 | R72.2 70.22,17.55 | R22.2 v43.55,10.94 | R23.2 v49.1,10.94 | R24.2 v54.82,10.94 | v59.42,10.94 59.9,11.42 59.9,16.69 60.76,17.55 R70.2 R72.2 | 89.11,65.39 89.9,65.39 90.63,65.42 92.35,65.42 93.73,66.8 v96.52,66.8 | R55.2 v111.27,69.96 111.27,72.28 110.22,73.33 R50.1 109.43,73.33 108.79,73.97 108.79,74.39 C50.2 108.47,74.76 107.52,75.71 107.36,75.71 | v70.22,17.61 70.22,17.55 | C7.1 52.49,52.91
  Top 0.508: END_STOP_V.3 23.6,18.24 R7.2 | v47.51,27.93 v36.08,27.93 35.98,27.93 R4.1 | 44.81,44.76 44.81,44.91 47.04,47.14 C11.A | R57.1 43.07,51.42 v43.23,51.26 | v43.23,46.82 43.23,45.55 43.39,45.39 | Q1.E 38.15,33.64 v35.29,33.64 | v35.29,33.64 35.45,33.64 | 32.08,57.61 32.08,60.95 | 32.08,60.95 32.08,64.57 32.27,64.76 | 32.08,57.61 32.27,57.61 32.72,57.17 FB1.1 | 32.08,57.61 31,57.61 | 31,57.61 30.95,57.61 R75.1 | R74.1 32.01,61.05 32.12,60.95 32.08,60.95 | C71.1 26.18,36.08 26.64,35.63 28.62,33.64 v35.29,33.64 | 70.6,57.84 70.85,58.09 | 70.85,58.09 IC10.TAB 70.85,57.84 | 70.85,58.09 70.85,64.06 | 71.45,58.51 71.36,58.09 70.85,58.09 | R72.2 68.81,17.55 68.83,17.53 | 70.22,17.55 76.5,17.55 R71.2
  Top 0.813: IC10.2 70.34,57.71 IC10.TAB | IC10.TAB 70.85,57.9 70.87,57.91 70.87,57.9 IC10.TAB
  Top 1.93: C14.A 66.98,60.02 68.33,58.67 70.36,58.67 70.36,58.66 IC10.TAB
  Bottom 0.254: v21.48,39.99 21.48,44.44 v21.32,44.76 | v21.32,50.15 v21.32,46.98 | v23.23,16.82 21.48,16.82 | 21.48,16.82 v20.68,16.82 | 21.48,16.82 21.64,16.97 v21.64,20.31 18.46,20.31 13.1,14.94 v8.65,14.94 | v36.08,25.86 35.13,25.86 v32.43,23.16
  Bottom 0.508: v83.39,68.73 83.39,68.09 84.15,67.33 v89.11,67.33 | v61.48,68.73 61.48,68.09 62.75,66.82 65.77,66.82 v67.2,65.39 | v39.58,68.73 39.58,68.09 40.85,66.82 43.86,66.82 v45.29,65.39 | v17.67,68.73 17.67,68.09 19.89,65.87 22.91,65.87 v24.02,65.23 | v59.42,10.94 v54.82,10.94 v49.1,10.94 v43.55,10.94 | v50.69,31.74 51.96,30.47 51.96,27.93 | 51.96,27.93 51.96,19.83 53.23,18.56 67.99,18.56 68.94,17.61 v70.22,17.61 | v35.29,33.64 35.29,28.72 v36.08,27.93 | v47.51,27.93 51.96,27.93 | v43.23,51.26 v43.23,46.82 | v96.52,66.8 97.54,67.82 104.65,67.82 | v105.3,68.73 105.3,68.47 104.65,67.82 | 104.65,67.82 109.73,67.82 111.25,69.34 111.25,69.95 v111.27,69.96
+12V  (via drill 0.3, 0.6, 0.76)
  Top 0.254: IC6.28 103.06,79.86 | IC6.22 106.59,79.86 | IC5.28 15.43,79.86 | IC5.22 18.96,79.86 | IC4.28 37.34,79.86 | IC4.22 40.87,79.86 | IC3.28 59.24,79.86 | IC3.22 62.77,79.86 | IC2.28 81.15,79.86 | IC2.22 84.68,79.86 | v29.26,19.2 29.26,20.31 30.37,21.42 30.53,21.42 30.53,21.26 R90.2 | C40.+ 50.04,77.22 50.04,77.47 | 71.88,77.47 71.88,77.22 C33.+ | C47.+ 28.18,77.71 28.19,77.72 | 6.35,77.47 6.35,77.22 C54.+ | C31.2 53.07,80.81 53.09,80.79
  Top 0.406: C47.+ 28.18,76.7 | 28.15,76.7 28.18,76.7 | 28.18,76.7 28.18,76.63 | 50.05,76.7 50.02,76.7 C40.+ | C33.+ 71.96,77.2 71.96,77.14 | 93.87,76.7 93.96,76.7 C23.+ | C54.+ 6.24,77.2 6.24,76.89
  Top 0.762: 103.06,79.86 102.92,80 102.76,80 v102.12,80.79 v101.33,81.58 | 106.59,79.86 106.73,80 106.89,80 v107.52,80.79 v108.31,81.58 | C53.2 111.97,80.95 v111.33,81.58 | 15.43,79.86 15.29,80 15.13,80 v14.49,80.79 v13.7,81.58 | 18.96,79.86 19.1,80 19.26,80 v19.89,80.79 v20.68,81.58 | C46.2 24.34,80.95 v23.7,81.58 | 37.34,79.86 37.2,80 37.04,80 v36.4,80.79 v35.61,81.58 | 40.87,79.86 41.01,80 41.16,80 v41.8,80.79 v42.59,81.58 | C38.2 32.11,80.95 32.75,81.58 | C39.2 46.25,80.95 v45.61,81.58 | 59.24,79.86 59.1,80 58.94,80 v58.31,80.79 v57.52,81.58 | 62.77,79.86 62.91,80 63.07,80 v63.71,80.79 v64.5,81.58 | C32.2 68.15,80.95 v67.52,81.58 | 81.15,79.86 81.01,80 80.85,80 v80.22,80.79 v79.42,81.58 | 84.68,79.86 84.82,80 84.98,80 v85.61,80.79 v86.41,81.58 | C22.2 90.06,80.95 v89.42,81.58
  Top 1.016: 93.87,76.7 v93.87,80.16 93.87,80.31 94.34,80.79 v95.14,80.79 97.04,80.79 97.2,80.95 C52.2 | 6.24,76.7 6.24,76.89 v6.24,80 6.24,80.31 6.71,80.79 v7.51,80.79 9.41,80.79 9.57,80.95 C45.2 | C44.2 10.52,72.19 v9.89,72.82 | 28.15,76.7 v28.15,80.16 28.15,80.31 28.62,80.79 v29.42,80.79 31.32,80.79 31.48,80.95 C38.2 | C37.2 32.43,72.19 v31.8,72.82 | 50.05,76.7 v50.05,80 50.05,80.31 50.53,80.79 v51.32,80.79 53.09,80.79 53.23,80.79 | C31.2 | C30.2 54.08,72.19 v53.45,73.08 | 71.96,76.7 71.96,77.14 v71.96,80.31 72.44,80.79 v73.23,80.79 75.14,80.79 75.3,80.95 C21.2 | C20.2 76.25,72.19 v75.61,72.82 | v29.97,77.72 28.19,77.72 | v73.66,77.47 71.88,77.47 | v51.56,77.47 50.04,77.47 | v7.87,77.47 6.35,77.47 | C51.2 98.47,72.22 v97.03,73.66 | v95.76,77.22 93.98,77.22 C23.+
  Bottom 0.254: 3.06,17.61 7.03,13.64 12.59,13.64 14.97,16.02 24.5,16.02 27.67,19.2 v29.26,19.2
  Bottom 0.508: 3.06,17.61 3.06,69.52 6.37,72.82 v9.89,72.82
  Bottom 0.762: v108.31,81.58 v111.33,81.58 | v20.68,81.58 v23.7,81.58 | v42.59,81.58 v45.61,81.58 | v64.5,81.58 v67.52,81.58 | v86.41,81.58 v89.42,81.58
  Bottom 1.016: v9.89,72.82 7.87,74.93 v7.87,77.47 | v31.8,72.82 29.97,74.17 v29.97,77.72 | v53.45,73.08 51.56,75.18 v51.56,77.47 | v75.61,72.82 73.66,74.93 v73.66,77.47 | v97.03,73.66 95.76,74.93 v95.76,77.22
  Bottom 2.032: v98.3,56.13 98.3,58.17 104.9,64.77 113.28,64.77 116.59,68.07 116.59,78.74
  other vias: 118.87,75.95 117.6,75.95 116.08,75.95 114.81,75.95 114.81,77.22 114.81,78.49 114.81,79.76 118.87,79.76 118.87,78.49 118.87,77.22 98.3,58.67 98.3,57.4
  pour Bottom (isolate 0.254, no thermals): 113.54,86.36 108.71,86.36 108.71,81.03 107.95,80.26 107.19,80.26 106.93,80.52 106.93,86.36 102.62,86.36 102.62,80.52 102.36,80.26 101.85,80.26 100.84,81.28 100.84,86.36 95.76,86.36 95.76,80.52 94.74,79.5 93.73,79.5 93.22,80.01 93.22,86.36 86.87,86.36 86.87,81.28 85.85,80.26 85.34,80.26 85.09,80.52 85.09,86.36 80.77,86.36 80.77,80.52 80.52,80.26 80.01,80.26 78.99,81.28 78.99,86.36 73.66,86.36 73.66,80.26 73.15,79.76 71.63,79.76 71.37,80.01 71.37,86.36 65.02,86.36 65.02,81.28 64.01,80.26 63.5,80.26 63.25,80.52 63.25,86.36 58.93,86.36 58.93,80.52 58.67,80.26 57.91,80.26 57.15,81.03 57.15,86.36 51.82,86.36 51.82,80.52 50.8,79.5 49.78,79.5 49.53,79.76 49.53,86.36 42.93,86.36 42.93,81.03 42.16,80.26 41.4,80.26 41.15,80.52 41.15,86.36 36.83,86.36 36.83,80.52 36.58,80.26 36.07,80.26 35.05,81.28 35.05,86.36 29.97,86.36 29.97,80.52 28.96,79.5 27.94,79.5 27.43,80.01 27.43,86.36 21.08,86.36 21.08,81.03 20.32,80.26 19.56,80.26 19.3,80.52 19.3,86.36 14.99,86.36 14.99,80.01 14.22,80.01 13.21,81.03 13.21,86.36 8.13,86.36 8.13,80.52 6.86,79.25 6.1,79.25 5.59,79.76 5.59,86.36 0,86.36 0,95 119.89,95 119.89,86.61 119.84,75.68 119.89,75.18 113.54,75.18
  pour Top (no thermals): 90.34,54.12 93.3,54.12 93.51,54.1 94.47,54.09 95.49,54.09 95.76,54.61 96.28,55.14 96.28,59.2 96.5,59.42 97.81,59.42 99.04,59.46 99.04,55.55 99.02,53.33 95.58,53.33 95.5,53.09 93.47,53.09 93.23,53.33 90.34,53.33 90.19,53.49 90.19,53.96
  pour Top (no thermals): 119.38,70.87 114.55,70.87 114.55,80.26 119.38,80.26
B_THERM  (via drill 0.3)
  Top 0.254: LPC1769.7 52.45,45.06 58.24,39.42 v58.24,39.36 | C27.2 57.89,21.36 v57.83,21.42
  Top 0.508: T_HB.2 58.31,10.52 R24.1 C27.2
  Bottom 0.254: v57.83,21.42 54.5,24.75 54.5,35.77 57.93,39.2 v58.24,39.36
D+
  Top 0.254: 16.89,32.32 16.86,32.32 16.75,32.44 17,32.44 16.91,32.53 16.91,32.58 R98.1
  Top 0.508: U$1.D+ 12.59,30.18 14.94,32.53 16.91,32.53 | R1.1 16.89,30.72 16.89,32.32
D-
  Top 0.254: R97.1 16.98,26.85
  Top 0.508: U$1.D- 15.53,29.91 16.88,28.56 | 16.88,28.56 17.03,28.4 17.03,28.56 R2.1 | R2.1 16.88,28.56 | R2.1 16.98,26.85 16.98,26.75
DIR_E0  (via drill 0.3)
  Top 0.254: IC2.19 89.02,77.96 92.12,74.85 v92.12,66.69 | LPC1769.56 63.7,38.56 v63.23,39.04
  Bottom 0.254: v63.23,39.04 64.02,38.25 66.41,38.25 67.52,37.13 69.42,37.13 70.53,38.25 70.53,55.55 79.3,64.31 90.72,64.31 92.12,65.71 v92.12,66.69
DIR_E1  (via drill 0.3)
  Top 0.254: LPC1769.37 57.33,31.24 v55.8,29.7 | IC6.19 112.13,77.96 113.11,76.98 v113.11,69.74
  Bottom 0.254: v55.8,29.7 61.77,29.7 63.55,27.93 67.67,27.93 72.75,33.01 72.75,36.82 71.8,37.77 71.8,55.23 79.77,63.2 94.28,63.2 98.28,67.2 111,67.18 113.11,69.29 v113.11,69.74
DIR_X  (via drill 0.3)
  Top 0.254: IC5.19 22.73,77.96 25.29,75.39 25.29,67.68 26.32,66.65 26.32,66.66 27.51,66.66 v27.99,67.14 | LPC1769.80 61.83,50.72 62.44,51.32 v62.44,51.8
  Bottom 0.254: v27.99,67.14 27.99,63.33 33.86,57.45 48.15,57.45 48.94,56.66 58.85,56.66 62.2,53.31 62.44,53.06 v62.44,51.8
DIR_Y  (via drill 0.3)
  Top 0.254: IC4.19 42.3,77.96 43.26,77.14 45.59,77.16 47.83,74.92 47.83,68.41 v48.62,67.61 | LPC1769.49 63.33,36.6 v63.07,36.82
  Bottom 0.254: v63.07,36.82 61.8,38.09 61.8,43.01 67.2,48.41 67.2,53.26 66.88,53.58 66.88,63.17 | v48.62,67.61 54.18,67.61 56.56,65.23 64.82,65.23 66.88,63.17 | 66.88,63.17 66.8,63.25
DIR_Z  (via drill 0.3)
  Top 0.254: IC3.19 67.3,77.96 70.53,74.73 v70.53,67.93 | LPC1769.58 67.16,39.56 v67.83,38.88
  Bottom 0.254: v67.83,38.88 68.15,38.88 68.94,39.67 68.94,55.71 71.17,57.93 71.17,67.3 v70.53,67.93
E0_H
  Top 0.254: LPC1769.68 75.84,44.56 80.35,40.04 R77.1 80.48,39.75 FET_DRV1.2
E0_THERM  (via drill 0.3)
  Top 0.254: LPC1769.9 51.39,44.06 55.89,39.57 v55.89,39.38 | C25.2 46.46,12.9 48.62,15.07 54.18,15.07 55.93,16.82 55.93,20.78 v55.29,21.42
  Top 0.508: T_E0.2 46.88,10.31 46.4,10.78 R22.1 C25.2
  Bottom 0.254: v55.29,21.42 55.29,21.58 53.23,23.64 53.23,36.72 v55.89,39.38
E1_H
  Top 0.254: LPC1769.67 73.93,44.06 77.22,40.77 77.22,39.37 78.23,38.35 80.01,38.35 80.35,38.01 R79.1 80.48,37.21 FET_DRV1.4
E1_THERM  (via drill 0.3)
  Top 0.254: LPC1769.8 52,44.56 56.98,39.58 v56.98,39.36 | C26.2 53.07,13.01 57.2,17.13 57.2,20.78 v56.56,21.42
  Top 0.508: T_E1.2 52.59,10.52 R23.1 C26.2
  Bottom 0.254: v56.98,39.36 53.86,36.25 53.86,23.96 56.4,21.42 v56.56,21.42
ENABLE_E0  (via drill 0.3)
  Top 0.254: IC2.2 76.68,78.46 74.17,75.95 v74.17,70.36 | LPC1769.57 64.2,39.06 v63.23,40.31
  Bottom 0.254: v63.23,40.31 64.18,39.2 64.18,39.04 66.56,39.04 67.83,37.77 68.47,37.77 69.58,38.88 69.58,55.55 71.8,57.77 71.8,66.66 73.71,68.57 73.91,68.83 74.17,69.09 v74.17,70.36
ENABLE_E1  (via drill 0.3)
  Top 0.254: LPC1769.36 56.83,31.85 v56.12,31.13 | v95.5,69.6 95.5,75.44 98.52,78.46 IC6.2
  Bottom 0.254: v56.12,31.13 61.29,31.13 63.87,28.56 67.52,28.56 72.12,33.17 72.12,36.34 71.17,37.29 71.17,55.39 79.56,63.81 92.26,63.81 95.51,66.99 95.51,68.83 v95.5,69.6
ENABLE_X  (via drill 0.3)
  Top 0.254: IC5.2 10.89,78.46 8.13,75.69 v8.13,69.6 | LPC1769.81 61.33,51.22 v61.33,51.26
  Bottom 0.254: v8.13,69.6 10.41,69.6 14.99,74.17 15.24,74.17 15.76,74.12 19.73,74.12 26.08,67.93 26.08,64.44 33.7,56.82 47.83,56.82 48.62,56.03 58.47,56.03 61.21,53.29 61.33,53.18 v61.33,51.26
ENABLE_Y  (via drill 0.3)
  Top 0.254: IC4.2 32.8,78.46 32.77,78.49 30.23,75.95 v30.23,70.61 | LPC1769.48 62.83,35.63 v62.44,36.02
  Bottom 0.254: v30.23,70.61 31.5,69.34 34.8,69.34 35.81,70.36 35.81,73.91 36.58,74.68 37.16,74.63 41.13,74.63 45.45,70.31 45.45,69.68 48.26,66.9 54.1,66.9 56.4,64.6 64.66,64.6 66.25,63.01 66.25,53.42 66.41,53.26 66.41,48.56 61.17,43.33 61.17,37.13 62.28,36.02 v62.44,36.02
ENABLE_Z  (via drill 0.3)
  Top 0.254: IC3.2 54.84,78.46 51.82,75.44 v51.82,70.87 | LPC1769.59 67.77,40.06 v67.99,39.83
  Bottom 0.254: v67.99,39.83 67.99,53.26 67.52,53.74 67.52,63.8 65.29,65.87 61.17,65.87 57.44,69.6 53.09,69.6 v51.82,70.87
ENC1  (via drill 0.3)
  Top 0.254: LPC1769.21 52.15,38.06 54.02,36.18 v56.82,36.18 | v68.15,30.63 69.1,29.67 69.1,24.59 69.64,24.05 75.2,24.05 75.77,23.48 84.34,23.48 86.22,21.61 v86.22,21.48
  Bottom 0.254: v56.82,36.18 57.2,36.18 64.18,29.2 66.72,29.2 v68.15,30.63 | v86.22,21.48 86.22,20.47 99.3,7.19 99.3,5.57 99.52,5.19 99.61,5.19 PANEL.6
ENC2  (via drill 0.3)
  Top 0.254: LPC1769.20 52.44,38.56 54.02,36.98 v57.67,36.98 | v67.99,31.58 68.31,31.58 69.74,30.15 69.74,24.91 69.96,24.69 75.68,24.69 76.25,24.12 84.98,24.12 v86.92,22.18
  Bottom 0.254: v57.67,36.98 57.67,36.5 64.34,29.83 66.25,29.83 v67.99,31.58 | v86.92,22.18 86.92,20.59 97.9,9.51 97.9,9.45 PANEL.5
ENC_CLK  (via drill 0.3)
  Top 0.254: LPC1769.52 66.67,36.56 75.61,27.61 75.61,26.21 76.06,25.77 81.95,25.76 82.47,25.77 v83.26,25.77
  Bottom 0.254: v83.26,25.77 85.42,24.12 85.42,20.05 96.76,8.74 96.76,5.44 96.83,5.44 PANEL.8
ENET_CRS  (via drill 0.3)
  Top 0.254: 38.15,49.36 R61.2 44.18,49.36 v44.66,48.88 | LPC1769.92 55.83,48.63 55.61,48.41 55.29,48.41 v55.13,48.25
  Bottom 0.254: v44.66,48.88 45.29,48.88 45.93,48.25 v55.13,48.25
ENET_MDC  (via drill 0.3)
  Top 0.254: U3.13 33.68,48.23 34.97,49.36 34.95,51.56 35.92,52.53 v43.86,52.53 | LPC1769.87 58.33,51.4 v57.36,52.38
  Bottom 0.254: v43.86,52.53 48.31,52.53 49.2,51.65 55.9,51.65 56.62,52.38 v57.36,52.38
ENET_MDIO  (via drill 0.3)
  Top 0.254: 36.5,51.21 35.61,50.31 35.61,48.29 U3.12 | R57.2 36.5,51.21 | 36.5,51.21 36.5,51.16 37.35,50.31 44.5,50.31 v44.66,50.15 | LPC1769.86 58.83,48.33 v58.53,48.02
  Bottom 0.254: v44.66,50.15 44.97,50.15 46.24,48.88 54.18,48.88 54.5,49.2 57.36,49.2 v58.53,48.02
ENET_REF_CLK  (via drill 0.3)
  Top 0.254: LPC1769.88 57.83,50.95 57.67,51.1 56.82,51.1 v56.66,51.26 | v45.77,51.74 44.18,53.49 41.96,53.49 41.8,53.33 U4.4 41.17,53.17
  Bottom 0.254: v56.66,51.26 56.6,51.26 56.39,51.05 46.47,51.03 v45.77,51.74
ENET_RX_ER  (via drill 0.3)
  Top 0.254: U3.10 36.44,46.27 R58.2 36.5,47.08 37.2,47.77 v44.66,47.77 | LPC1769.89 57.33,47.32 v57.58,47.07
  Bottom 0.254: v44.66,47.77 45.45,47.77 45.93,47.3 57.2,47.3 v57.58,47.07
ENET_RXD0  (via drill 0.3)
  Top 0.254: R59.2 39.1,44.76 v39.42,45.07 | LPC1769.91 56.33,47.54 v54.66,45.87
  Bottom 0.254: v54.66,45.87 54.02,45.07 v39.42,45.07
ENET_RXD1  (via drill 0.3)
  Top 0.254: R60.2 38.2,42.75 v39.42,43.96 | LPC1769.90 56.83,46.61 v55.45,45.23
  Bottom 0.254: v39.42,43.96 39.73,44.28 54.5,44.28 v55.45,45.23
ENET_TX_EN  (via drill 0.3)
  Top 0.254: U3.16 32.18,49.74 33.38,50.95 v33.38,52.22 | LPC1769.93 55.33,51.59 55.65,51.59 56.26,52.2 v56.28,53.04
  Bottom 0.254: v33.38,52.22 40.69,52.22 43.07,54.6 54.72,54.6 v56.28,53.04
ENET_TXD0  (via drill 0.3)
  Top 0.254: U3.17 31.68,50.35 v32.12,50.79 | LPC1769.95 54.33,52.22 v53.86,52.69
  Bottom 0.254: v32.12,50.79 41.01,50.79 43.55,53.33 53.23,53.33 v53.86,52.69
ENET_TXD1  (via drill 0.3)
  Top 0.254: U3.18 31.18,51.28 v31.64,51.74 | LPC1769.94 54.83,52 v55.36,52.53
  Bottom 0.254: v31.64,51.74 32.27,51.74 32.59,51.42 40.69,51.42 43.23,53.96 53.93,53.96 v55.36,52.53
FAN1  (via drill 0.3)
  Top 0.254: R16.2 61.11,15.81 v60.73,16.18 | LPC1769.32 54.83,33.02 48.78,26.98 48.31,26.98 v44.81,23.48
  Top 0.406: Q2.G 60.96,14.66 R16.2
  Bottom 0.254: v60.73,16.18 52.12,16.18 v44.81,23.48
FAN2  (via drill 0.3)
  Top 0.254: R18.2 66.91,15.65 v66.37,16.18 | LPC1769.33 55.33,32.73 v45.93,23.48
  Top 0.406: Q3.G 66.8,14.67 66.94,14.81 | R18.2 66.94,14.81 | 66.94,14.81 67.04,14.91
  Bottom 0.254: v66.37,16.18 63.71,16.18 62.75,17.13 52.28,17.13 v45.93,23.48
FAN3  (via drill 0.3)
  Top 0.254: R20.2 72.62,15.81 72.25,16.18 v71.8,16.18 | LPC1769.34 55.83,31.96 v47.35,23.48
  Top 0.406: Q4.G 72.39,14.57 R20.2
  Bottom 0.254: v71.8,16.18 69.42,16.18 67.67,17.93 52.91,17.93 v47.35,23.48
GND  (via drill 0.25, 0.3, 0.6)
  Top 0.254: U$8.GND2 35.72,38.24 C64.2 | IC6.3 103.71,77.96 v103.71,77.46 | IC6.18 v105.93,77.46 | IC5.3 16.08,77.96 v16.08,77.46 | IC5.18 v18.3,77.46 | IC4.3 37.99,77.96 v37.99,77.46 | IC4.18 v40.21,77.46 | IC3.3 59.9,77.96 v59.9,77.46 | IC3.18 v62.12,77.46 | IC2.3 81.8,77.96 v81.8,77.46 | IC2.18 v84.03,77.46 | 60.88,53 C10.2 61.47,52.58 61.21,52.58 60.45,51.82
  Top 0.762: 59.96,29.13 59.74,29.36 C8.2 | HOTBET_FET.3 95.28,16.28 HOTBET_FET.3 | 95.23,26.11 95.26,26.09 95.23,26.36 | 95.23,36.77 E0_FET.3 95.23,36.78
  Top 1.016: HOTBET_FET.3 95.28,16.79 95.26,16.82 arc29 95.26,17.07 HOTBET_FET.3 | HOTBET_FET.3 95.23,15.16 | HOTBET_FET.3 96.53,16.31 | HOTBET_FET.3 93.99,16.31 | 95.23,26.11 95.26,26.59 95.23,26.62 arc29 95.23,27.89 95.23,26.36 | 95.23,26.36 95.21,25.22 | 95.23,26.36 96.5,26.36 | 95.23,26.36 93.96,26.36 | 95.23,36.77 95.26,37.26 95.23,37.29 arc29 95.23,37.54 95.23,36.78 | 95.23,36.78 95.21,35.64 | 95.23,36.78 96.5,36.78 | 95.23,36.78 93.96,36.78
  Top 1.524: D1.A 88.44,57 88.44,56.98
  Top 1.93: D2.A 107.44,45.72 | 107.44,43.94 106.17,43.94 106.17,47.24
  Top 2.54: D1.A 88.85,56.18
  other vias: 31.96,46.5 31.96,45.55 48.47,38.4 104.82,77.46 103.71,78.57 104.82,78.57 105.93,78.57 105.93,76.35 104.82,76.35 103.71,76.35 17.19,77.46 16.08,78.57 17.19,78.57 18.3,78.57 18.3,76.35 17.19,76.35 16.08,76.35 39.1,77.46 37.99,78.57 39.1,78.57 40.21,78.57 40.21,76.35 39.1,76.35 37.99,76.35 61.01,77.46 59.9,78.57 61.01,78.57 62.12,78.57 62.12,76.35 61.01,76.35 59.9,76.35 82.91,77.46 81.8,78.57 82.91,78.57 84.03,78.57 84.03,76.35 82.91,76.35 81.8,76.35 32.91,46.5 32.91,45.55 17.51,56.03 62.75,41.42 51.64,42.69 51.8,46.18 63.71,43.48 70.69,29.23 73.23,25.8 61.8,21.26 68.15,21.58 56.56,15.07 58.78,15.07 63.07,8.88 67.77,16.15 74.5,8.72 39.89,53.96 23.7,54.12 26.88,50.47 26.94,39.87 58.03,26.43 57.01,25.39 58.02,25.41 73.93,67.17 75.77,62.85 78.86,44.56 77.83,44.56 75.54,43.8 44.66,42.69 39.26,22.69 40.69,22.69 39.26,20.62 68.12,4.05 23.29,52.6 58.94,36.5 49.26,33.01 36.4,30.94 40.85,48.56 51.01,50.15 45.26,62.92 37.04,53.49 54.18,68.41 37.35,65.71 88.66,54.6 88.66,51.74 88.66,53.17 57.67,70.79 64.66,56.34 63.52,55.61 101.49,70.79 41.48,24.91 67.2,74.12 23.38,73.81 45.45,73.96 89.42,73.81 77.23,4.88 65.93,6.34 55.18,20.13 87.7,21.14 89.74,22.15 43.28,13.67 43.29,12.66 48.62,13.48 48.63,12.46 80.85,65.71 90.06,68.57 90.06,70.95 110.28,70.82 64.18,67.77 42.27,67.77 20.37,67.77 96.79,72.12 93.87,74.92 94,70.09 86.09,67.93 24.49,46.5 25.61,31.61 26.53,32.53 25.61,32.53 26.53,31.61 64.82,49.52 56.09,67.3 23.22,68.73 46.08,30.47 35.39,19.77 30.21,17.29 77.36,19.39 44.4,25.77 45.32,26.69 44.4,26.69 45.32,25.77 31.96,35.17 32.88,36.09 31.96,36.09 32.88,35.17 40.34,33.9 41.26,34.82 40.34,34.82 41.26,33.9 25.35,26.78 26.27,27.71 25.35,27.71 26.27,26.78 95.23,17.96 93.33,16.36 95.23,14.66 95.23,24.82 95.23,28.12 93.3,26.42 95.23,34.98 95.23,38.53 93.23,36.88 49.99,24.5 80.12,35.58 77.93,32.02 80.37,32.12 70.96,36.18 73.74,33.04 57.01,26.43 32.59,68.22 33.61,68.22 33.61,67.2 32.59,67.2 30.56,65.93 31.58,65.93 71.96,69.68 72.98,69.68 71.96,68.66 50.15,16.28 48.85,66.12 69.48,60.66 81.04,53.68 82.57,53.68 79.52,53.68 96.79,60.79 95.52,60.79 98.06,60.79 94.25,60.79 101.62,56.72 101.62,55.45 100.35,55.45 101.62,53.93 59.9,43.99 59.9,40.94 111.52,73.9 66.25,32.82 67.01,35.1 78.08,41.26 77.31,38.21 51.93,60.31 54.47,60.31 56.5,60.31 51.42,58.28 52.43,58.28 54.97,58.03 56.24,58.03 73.87,28.24 75.83,14.31 79.9,7.45 87.49,36.18 33.32,63.42 98.06,76.6 76.22,76.6 32.27,76.6 10.43,76.35 54.37,76.6
  pour Top (isolate 0.229, rank 2): 0,0 0.21,93.97 120,94 120,0
  pour Bottom (rank 6): 0,95 119.89,95 120,38.6 110.41,38.6 110.25,12.4 120,12.4 120,0 0,0
  pour Top (no thermals): 112.52,47.75 118.36,47.75 118.36,43.43 112.52,43.43
  pour Top (no thermals): 113.03,57.91 118.36,57.91 118.36,53.85 113.03,53.85
  pour Bottom (rank 2, no thermals): 112.52,57.91 118.62,57.91 118.62,53.59 112.52,53.59
  pour Bottom (rank 2, no thermals): 112.78,47.75 118.62,47.75 118.62,43.43 112.78,43.43
HB_H
  Top 0.254: LPC1769.66 73.54,43.56 76.45,40.64 76.45,37.08 78.74,34.8 79.08,34.8 R81.1 80.48,33.66 FET_DRV2.2
LCD_A0  (via drill 0.3)
  Top 0.254: LPC1769.50 65.11,34.31 v65.29,34.12 | v71.17,34.12 74.18,34.12 75.18,33.12 75.18,30.48 76.2,29.46 78.84,29.46 v79.58,28.72
  Bottom 0.254: v65.29,34.12 v71.17,34.12 | v79.58,28.72 79.71,28.5 79.9,28.31 79.9,14.24 86.6,7.59 86.62,5.62 86.74,5.37 PANEL.16
LCD_CS  (via drill 0.3)
  Top 0.254: LPC1769.63 72.6,42.06 74.41,40.31 74.67,40.04 v74.67,38.05
  Bottom 0.254: v74.67,38.05 74.66,37.71 74.66,17.29 84.06,7.94 84.06,5.51 PANEL.18
LCD_MISO  (via drill 0.3)
  Top 0.254: LPC1769.61 70.58,41.06 76.98,34.66 76.96,31.75 77.47,31.24 80.16,31.24 81.34,30.06 81.58,29.83 82.28,29.13 v82.28,28.19
  Bottom 0.254: v82.28,28.19 82.28,15.16 90.41,7.04 PANEL.13
LCD_MOSI  (via drill 0.3)
  Top 0.254: LPC1769.60 70.13,40.56 76.44,33.99 76.45,31.5 77.32,30.66 78.54,30.66 79.29,30.66 79.73,30.66 81.47,28.93 v81.48,27.57
  Bottom 0.254: v81.48,27.57 81.49,25.61 81.49,14.85 89.14,7.27 89.14,5.65 89.25,5.4 PANEL.14
LCD_RST  (via drill 0.3)
  Top 0.254: LPC1769.65 72.68,43.06 73.18,42.58 75.42,40.31 75.65,40.08 v75.65,37.17
  Bottom 0.254: v75.65,37.17 75.64,36.82 75.64,17.64 85.33,7.96 PANEL.17
LCD_SCK  (via drill 0.3)
  Top 0.254: LPC1769.62 71.51,41.56 73.83,39.24 v73.83,38.82 | v80.68,26.98 80.68,28.96 79.49,30.15 76.53,30.15 75.69,30.99 75.69,32 75.68,33.86 74.31,35.23 v73.87,35.23
  Bottom 0.254: v80.68,26.98 80.69,25.29 80.69,14.62 87.87,7.45 PANEL.15 | v73.83,38.82 73.86,38.75 73.87,38.44 v73.87,35.23
LED1/REGOFF  (via drill 0.3)  (1 unrouted)
  Top 0.254: U3.3 32.18,42.76 v31.96,42.53
  Bottom 0.254: v31.96,42.53 30.21,42.53 27.51,45.39 21.8,45.39 20.68,46.5 19.41,46.5 18.14,47.77 14.88,47.77 13.79,46.69 9.54,46.69 9.23,46.69 6.69,46.69 5.45,47.93 5.45,50.47 6.07,51.1
LED2/NINTSEL  (via drill 0.3)  (1 unrouted)
  Top 0.254: U3.2 31.68,43.31 31.07,42.7 v31.07,41.74
  Bottom 0.254: v31.07,41.74 28.05,38.72 16.11,38.72 12.84,41.99 8.71,41.99 7.67,40.95 7.67,38.25 7.64,38.27 7.37,38
N$1
  Top 1.016: U$1.VBUS 14.57,26.06 F1.2
N$2
  Top 0.508: Q1.B 40.06,31.26 R3.2
N$3  (via drill 0.6)
  Top 0.254: R97.2 19.02,26.83 18.97,26.78 | 18.78,32.69 18.78,32.94 19.02,32.71 R98.2 18.86,32.85 18.77,32.85
  Top 0.406: 19.02,32.71 19.11,32.71 v20.21,33.8 22.94,33.8 FB3.2
  Top 0.508: v19.26,25.58 19.26,25.55 19.1,25.7 19.1,26.66 18.97,26.78 18.91,26.85
  Bottom 0.508: v19.26,25.58 19.26,32.85 v20.21,33.8 19.73,33.33 12.43,33.33 11.08,34.68 U$1.S2
  Bottom 1.016: U$1.S1 U$1.S2
N$4
  Top 0.762: LED2.C 64.5,10.78 62.4,10.78 Q2.D 61.8,11.07 FAN1.1
N$5
  Top 0.762: FAN2.1 67.52,10.92 Q3.D 68.33,10.69 LED3.C
N$6
  Top 0.254: C13.1 47.2,35.12 U$3.XTAL1 47.2,35.87 47.51,35.87 48.7,37.06 LPC1769.23
N$7
  Top 0.254: LPC1769.22 48.41,37.56 47.99,37.13 45.77,37.13 45.61,37.29 45.61,38.07 U$3.XTAL2 45.55,38.13 C12.1
N$8
  Top 0.254: IC2.21 85.37,78.96 85.45,79.05
  Top 0.508: 88,80 86.36,80 85.45,79.1 85.45,79.05
  Top 1.016: E0_AXIS.1 88,88.73 88,80
N$9
  Top 0.254: IC2.24 83.42,81.77 83.55,82.06
  Top 1.016: E0_AXIS.2 83.55,89.36 83.55,82.06
N$10
  Top 0.508: 3V3.A R4.2 33.23,27.13
N$11
  Top 0.254: LPC1769.12 48.17,42.56 48.15,42.53 L2.1 48.15,42.59 48.15,43.48 | LPC1769.10 48.22,43.56 48.15,43.48 | C3.1 47.89,43.75 48.15,43.48
N$12
  Top 0.254: IC2.26 82.42,79.97 82.44,80 82.44,81.74 82.28,82.06
  Top 1.016: E0_AXIS.3 82.28,89.36 82.28,82.06
N$13
  Top 0.254: IC2.1 80.46,78.96 80.38,79.05
  Top 0.508: 77.83,80 79.47,80 80.38,79.1 80.38,79.05
  Top 1.016: E0_AXIS.4 77.83,88.73 77.83,80
N$14
  Top 0.254: IC2.12 83.42,73.94 84.03,73.33 84.03,71.9 83.71,71.58 82.92,71.58 R8.2
N$15
  Top 0.254: R9.2 84.42,74.79 IC2.14
N$16
  Top 0.254: R11.2 87.2,71.58 85.19,71.58 R10.2 84.82,71.64 84.82,73.49 84.34,73.97 84.19,73.97 83.92,74.23 IC2.13
N$17
  Top 0.254: IC2.8 81.42,74.69 80.53,73.81 80.53,71.74 80.64,71.64 C16.1
N$18
  Top 0.254: IC2.5 78.82,76.96 C18.2
N$19
  Top 0.254: IC2.4 77.62,77.46 C18.1
N$20
  Top 0.254: IC2.27 81.92,80.84 81.8,80.95
  Top 0.508: 81.8,80.95 80.69,82.06
  Top 0.762: 80.69,82.06 80.69,84.44 R12.1
N$21
  Top 0.254: IC2.23 83.92,80.84 84.03,80.95
  Top 0.508: 84.03,80.95 85.14,82.06
  Top 0.762: 85.14,82.06 85.14,84.39 R13.1
N$22
  Top 0.254: IC2.6 79.53,76.46 78.63,75.55 78.63,74.95 77.52,73.84 C20.1
N$23  (via drill 0.3, 0.3 pad 0.3)
  Top 0.254: 81.96,68.09 MS1.2 81.96,67.93 | 81.96,68.09 v81.96,68.89 | R15.1 81.91,68.15 81.96,68.09 | IC2.9 81.92,73.76 v81.33,73.33
  Bottom 0.254: v81.33,73.33 81.33,69.36 v81.96,68.89
N$24  (via drill 0.3, 0.3 pad 0.3)
  Top 0.254: IC2.10 82.44,75.03 82.44,73.01 v82.28,73.01 | MS2.2 v84.82,68.73
  Bottom 0.254: v84.82,68.73 82.44,71.11 82.44,73.01 v82.28,73.01
N$25  (via drill 0.3, 0.3 pad 0.3)
  Top 0.254: IC2.11 82.92,73.65 83.23,73.33 v83.23,72.85 | MS3.2 v87.52,68.73
  Bottom 0.254: v87.52,68.73 86.72,68.73 83.23,72.22 v83.23,72.85
N$26
  Top 0.254: MS1.1 81.99,66.98 84.82,66.98 MS2.1 85.45,67.01 | 85.45,67.01 MS3.1 | R14.1 85.45,65.39 85.45,67.01
N$27
  pour Top (no thermals): 118.87,59.69 114.05,59.69 114.05,69.09 118.87,69.09
N$28
  Top 0.813: LED8.C 103.4,14.62 102.85,18.72 102.7,18.72 HOTBET_FET.4 102.56,18.51 102.6,18.47
  Top 4.064: 102.85,19.25 102.6,19.09 102.6,18.47 102.6,18.21
  pour Top (isolate 0.305, no thermals): 97.79,21.84 118.87,21.84 118.87,15.24 113.79,15.24 111.25,12.7 97.79,12.7
N$29
  Top 0.813: LED7.C 103.14,24.76 E1_FET.4
  pour Top (isolate 0.305, no thermals): 97.79,32 118.87,32 118.87,25.65 113.79,25.65 111,22.86 98.04,23.11
N$30
  Top 0.813: 104.92,36.68 E0_FET.4
  pour Top (isolate 0.305, no thermals): 118.87,42.42 98.04,42.42 98.04,33.02 111,33.02 114.05,36.07 118.87,36.07
N$31
  Top 0.762: E0_FET.1 93.23,41.32 R76.1
N$32
  Top 0.762: E1_FET.1 93.76,30.93 R78.1
N$33
  Top 0.762: FET_DRV1.7 93.09,39.75 93.22,39.62 93.17,39.58 R76.2
N$34
  Top 0.508: R94.2 105.81,33.26 LED6.A
N$36
  Top 0.508: Q1.C 35.29,32.21 34.66,31.58 R73.2
N$37
  Top 0.254: IC3.21 63.46,78.96 63.55,79.05
  Top 0.508: 66.09,80 64.45,80 63.55,79.1 63.55,79.05
  Top 1.016: Z_AXIS.1 66.09,88.73 66.09,80
N$38
  Top 0.254: IC3.24 61.51,81.77 61.64,82.06
  Top 1.016: Z_AXIS.2 61.64,89.36 61.64,82.06
N$39
  Top 0.254: IC3.26 60.51,79.97 60.53,80 60.53,81.74 60.37,82.06
  Top 1.016: Z_AXIS.3 60.37,89.36 60.37,82.06
N$41
  Top 0.254: IC3.1 58.55,78.96 58.47,79.05
  Top 0.508: 55.93,80 57.57,80 58.47,79.1 58.47,79.05
  Top 1.016: Z_AXIS.4 55.93,88.73 55.93,80
N$42
  Top 0.406: LED3.A R19.2
N$43
  Top 0.508: END_STOP_V.2 25.77,17.45 24.18,15.86 22.27,15.86 21.48,15.07 X_MIN.2
  Top 0.762: 29.89,3.64 23.23,3.64 21.48,5.38 X_MAX.2 X_MIN.2 | 29.89,3.64 36.24,3.64 38.31,5.7 Z_MAX.2 Z_MIN.2 | 29.89,3.64 Y_MAX.2 Y_MIN.2
N$44
  Top 0.406: LED2.A R17.2
N$45
  Top 0.762: FAN3.1 73.23,11.05 Q4.D 73.91,10.69 LED4.C
N$46
  Top 0.406: LED4.A R21.2
N$47
  Top 0.254: IC3.12 61.51,73.94 62.12,73.33 62.12,71.9 61.8,71.58 61.01,71.58 R25.2
N$48
  Top 0.254: R26.2 62.51,74.79 IC3.14
N$49
  Top 0.254: R28.2 65.29,71.58 63.29,71.58 R27.2 62.91,71.64 62.91,73.49 62.44,73.97 62.28,73.97 62.01,74.23 IC3.13
N$50